# Altium project Connector.PrjPcb
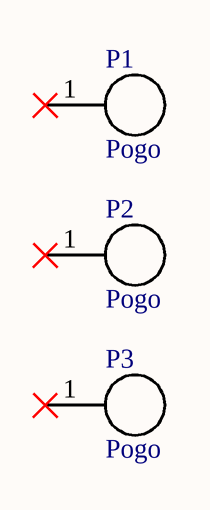
[diagram p0: Connector.SchDoc]
1 sheet, 3 parts. Net scope: global (net labels, ports and power ports of the same name join across sheets).
Board file: Connector.PcbDoc

## Sheet Connector.SchDoc
size A4; SheetNumber: 1; SheetTotal: 1

### Parts
P1  Pogo  [POGO]
P2  Pogo  [POGO]
P3  Pogo  [POGO]

### Nets

Not connected (* = marked no-connect by the designer): P1 1*; P2 1*; P3 1*